# EAGLE design BaseBoard (EAGLE 6.5.0)
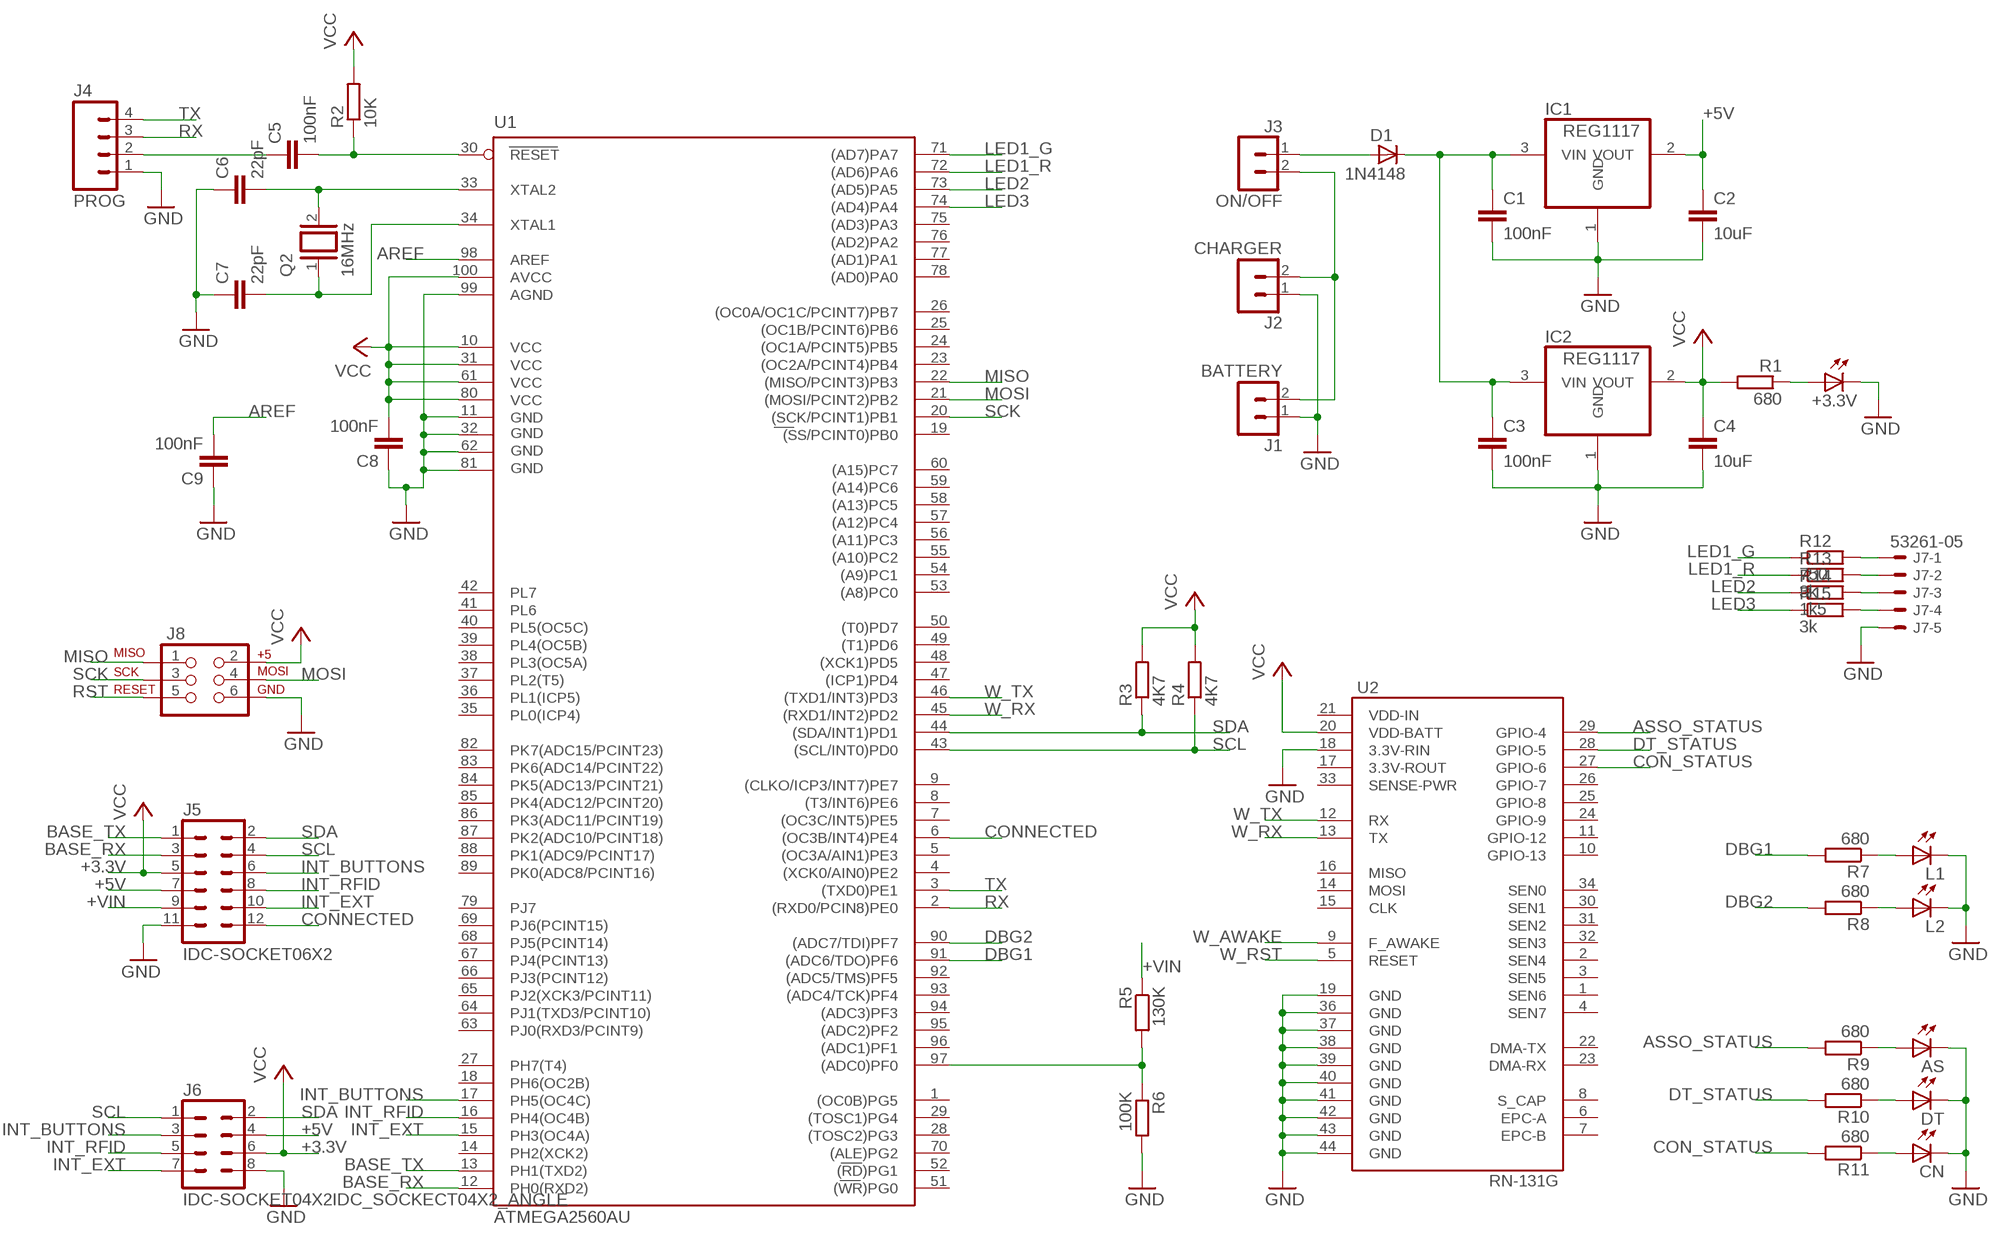
[diagram p0: schematic, sheet 1]

## Parts
+3.3V  LEDSML0805  [SML0805]
AS  LEDSML0805  [SML0805]
C1  100nF  C-EUC0805  [C0805]
C2  10uF  C-EUC0805  [C0805]
C3  100nF  C-EUC0805  [C0805]
C4  10uF  C-EUC0805  [C0805]
C5  100nF  C-EUC0805  [C0805]
C6  22pF  C-EUC0805  [C0805]
C7  22pF  C-EUC0805  [C0805]
C8  100nF  C-EUC0805  [C0805]
C9  100nF  C-EUC0805  [C0805]
CN  LEDSML0805  [SML0805]
D1  1N4148  [D0805]
DT  LEDSML0805  [SML0805]
IC1  REG1117  [SOT223]
IC2  REG1117  [SOT223]
J1  BATTERY  CON02  [CON_2P_SMD]
J2  CHARGER  CON02  [CON_2P_SMD]
J3  ON/OFF  CON02  [CON_2P_SMD]
J4  PROG  M04PTH  [1X04]
J5  IDC-SOCKET06X2  [SOCKET06X2]
J6  IDC-SOCKET04X2IDC_SOCKECT04X2_ANGLE  [SOCKET04X2_ANGLE]
J7  53261-05  [53261-05]
J8  AVR_SPI_PRG_6NS  [2X3-NS]
L1  LEDSML0805  [SML0805]
L2  LEDSML0805  [SML0805]
Q2  16MHz  XTAL/S  [QS]
R1  680  R-EU_R0805  [R0805]
R2  10K  R-EU_R0805  [R0805]
R3  4K7  R-EU_R0805  [R0805]
R4  4K7  R-EU_R0805  [R0805]
R5  130K  R-EU_R0805  [R0805]
R6  100K  R-EU_R0805  [R0805]
R7  680  R-EU_R0805  [R0805]
R8  680  R-EU_R0805  [R0805]
R9  680  R-EU_R0805  [R0805]
R10  680  R-EU_R0805  [R0805]
R11  680  R-EU_R0805  [R0805]
R12  750  R-EU_R0805  [R0805]
R13  3k  R-EU_R0805  [R0805]
R14  1k5  R-EU_R0805  [R0805]
R15  3k  R-EU_R0805  [R0805]
U1  ATMEGA2560AU  [TQFP100]
U2  RN-131G  [RN-131G]

## Nets
+5V: C2.1 IC1.2(VOUT) J5.7 J6.4
+VIN: C1.1 C3.1 D1.C IC1.3(VIN) IC2.3(VIN) J5.9 R5.1
AREF: C9.2 U1.98(AREF)
ASSO_STATUS: R9.2 U2.29(GPIO-4)
BASE_RX: J5.3 U1.12(PH0(RXD2))
BASE_TX: J5.1 U1.13(PH1(TXD2))
BAT: R5.2 R6.1 U1.97((ADC0)PF0)
CON_STATUS: R11.2 U2.27(GPIO-6)
CONNECTED: J5.12 U1.6((OC3B/INT4)PE4)
DBG1: R7.2 U1.91((ADC6/TDO)PF6)
DBG2: R8.2 U1.90((ADC7/TDI)PF7)
DT_STATUS: R10.2 U2.28(GPIO-5)
GND: +3.3V.C AS.C C1.2 C2.2 C3.2 C4.2 C6.1 C7.1 C8.1 C9.1 CN.C DT.C IC1.1(GND) IC2.1(GND) J1.1 J2.1 J4.1 J5.11 J6.8 J7.5 J8.6 L1.C L2.C R6.2 U1.11(GND) U1.32(GND1) U1.62(GND2) U1.81(GND3) U1.99(AGND) U2.18(3.3V-RIN) U2.19(GND) U2.36(GND) U2.37(GND) U2.38(GND) U2.39(GND) U2.40(GND) U2.41(GND) U2.42(GND) U2.43(GND) U2.44(GND)
INT_BUTTONS: J5.6 J6.3 U1.17(PH5(OC4C))
INT_EXT: J5.10 J6.7 U1.15(PH3(OC4A))
INT_RFID: J5.8 J6.5 U1.16(PH4(OC4B))
LED1_G: R12.1 U1.71((AD7)PA7)
LED1_R: R13.1 U1.72((AD6)PA6)
LED2: R14.1 U1.73((AD5)PA5)
LED3: R15.1 U1.74((AD4)PA4)
MISO: J8.1 U1.22((MISO/PCINT3)PB3)
MOSI: J8.4 U1.21((MOSI/PCINT2)PB2)
N$1: AS.A R9.1
N$2: D1.A J3.1
N$3: J1.2 J2.2 J3.2
N$4: DT.A R10.1
N$5: C5.1 J4.2
N$6: J7.1 R12.2
N$7: C7.2 Q2.1 U1.34(XTAL1)
N$8: C6.2 Q2.2 U1.33(XTAL2)
N$9: CN.A R11.1
N$10: +3.3V.A R1.1
N$11: J7.2 R13.2
N$12: J7.3 R14.2
N$13: J7.4 R15.2
N$14: L1.A R7.1
N$15: L2.A R8.1
RST: C5.2 J8.5 R2.1 U1.30(RESET)
RX: J4.3 U1.2((RXD0/PCIN8)PE0)
SCK: J8.3 U1.20((SCK/PCINT1)PB1)
SCL: J5.4 J6.1 R4.1 U1.43((SCL/INT0)PD0)
SDA: J5.2 J6.2 R3.1 U1.44((SDA/INT1)PD1)
TX: J4.4 U1.3((TXD0)PE1)
VCC: C4.1 C8.2 IC2.2(VOUT) J5.5 J6.6 J8.2 R1.2 R2.2 R3.2 R4.2 U1.10(VCC) U1.31(VCC1) U1.61(VCC2) U1.80(VCC3) U1.100(AVCC) U2.20(VDD-BATT)
W_AWAKE: U2.9(F_AWAKE)
W_RST: U2.5(RESET)
W_RX: U1.45((RXD1/INT2)PD2) U2.13(TX)
W_TX: U1.46((TXD1/INT3)PD3) U2.12(RX)
Unconnected: U1.1((OC0B)PG5) U1.4((XCK0/AIN0)PE2) U1.5((OC3A/AIN1)PE3) U1.7((OC3C/INT5)PE5) U1.8((T3/INT6)PE6) U1.9((CLKO/ICP3/INT7)PE7) U1.14(PH2(XCK2)) U1.18(PH6(OC2B)) U1.19((SS/PCINT0)PB0) U1.23((OC2A/PCINT4)PB4) U1.24((OC1A/PCINT5)PB5) U1.25((OC1B/PCINT6)PB6) U1.26((OC0A/OC1C/PCINT7)PB7) U1.27(PH7(T4)) U1.28((TOSC2)PG3) U1.29((TOSC1)PG4) U1.35(PL0(ICP4)) U1.36(PL1(ICP5)) U1.37(PL2(T5)) U1.38(PL3(OC5A)) U1.39(PL4(OC5B)) U1.40(PL5(OC5C)) U1.41(PL6) U1.42(PL7) U1.47((ICP1)PD4) U1.48((XCK1)PD5) U1.49((T1)PD6) U1.50((T0)PD7) U1.51((WR)PG0) U1.52((RD)PG1) U1.53((A8)PC0) U1.54((A9)PC1) U1.55((A10)PC2) U1.56((A11)PC3) U1.57((A12)PC4) U1.58((A13)PC5) U1.59((A14)PC6) U1.60((A15)PC7) U1.63(PJ0(RXD3/PCINT9)) U1.64(PJ1(TXD3/PCINT10)) U1.65(PJ2(XCK3/PCINT11)) U1.66(PJ3(PCINT12)) U1.67(PJ4(PCINT13)) U1.68(PJ5(PCINT14)) U1.69(PJ6(PCINT15)) U1.70((ALE)PG2) U1.75((AD3)PA3) U1.76((AD2)PA2) U1.77((AD1)PA1) U1.78((AD0)PA0) U1.79(PJ7) U1.82(PK7(ADC15/PCINT23)) U1.83(PK6(ADC14/PCINT22)) U1.84(PK5(ADC13/PCINT21)) U1.85(PK4(ADC12/PCINT20)) U1.86(PK3(ADC11/PCINT19)) U1.87(PK2(ADC10/PCINT18)) U1.88(PK1(ADC9/PCINT17)) U1.89(PK0(ADC8/PCINT16)) U1.92((ADC5/TMS)PF5) U1.93((ADC4/TCK)PF4) U1.94((ADC3)PF3) U1.95((ADC2)PF2) U1.96((ADC1)PF1) U2.1(SEN6) U2.2(SEN4) U2.3(SEN5) U2.4(SEN7) U2.6(EPC-A) U2.7(EPC-B) U2.8(S_CAP) U2.10(GPIO-13) U2.11(GPIO-12) U2.14(MOSI) U2.15(CLK) U2.16(MISO) U2.17(3.3V-ROUT) U2.21(VDD-IN) U2.22(DMA-TX) U2.23(DMA-RX) U2.24(GPIO-9) U2.25(GPIO-8) U2.26(GPIO-7) U2.30(SEN1) U2.31(SEN2) U2.32(SEN3) U2.33(SENSE-PWR) U2.34(SEN0)

## Notes on the sheet
- +3.3V
- +3.3V

## Library data of the parts
+3.3V AS CN DT L1 L2 = led:LED: LED OSRAM: - CHIPLED LG R971, LG N971, LY N971, LG Q971, LY Q971, LO R971, LY R971 LH N974, LH R974 LS Q976, LO Q976, LY Q976 LO Q996 - Hyper CHIPLED LW Q18S LB Q993, LB Q99A, LB R99A - SideLED LS A670, LO A670, LY A670, LG A670, LP A670 LB A673, LV A673, LT A673, LW A673 LH A674 LY A675 LS A676, LA A676, LO A676, LY A676, LW A676 LS A679, LY A679, LG A679 - Hyper Micro SIDELED® LS Y876, LA Y876, LO Y876, LY Y876 LT Y87S - SmartLED LW L88C, LW L88S LB L89C, LB L89S, LG L890 LS L89K, LO L89K, LY L89K LS L896, LA L896, LO L896, LY L896 - TOPLED LS T670, LO T670, LY T670, LG T670, LP T670 LSG T670, LSP T670, LSY T670, LOP T670, LYG T670 LG T671, LOG T671, LSG T671 LB T673, LV T673, LT T673, LW T673 LH T674 LS T676, LA T676, LO T676, LY T676, LB T676, LH T676, LSB T676, LW T676 LB T67C, LV T67C, LT T67C, LS T67K, LO T67K, LY T67K, LW E67C LS E67B, LA E67B, LO E67B, LY E67B, LB E67C, LV E67C, LT E67C LW T67C LS T679, LY T679, LG T679 LS T770, LO T770, LY T770, LG T770, LP T770 LB T773, LV T773, LT T773, LW T773 LH T774 LS E675, LA E675, LY E675, LS T675 LS T776, LA T776, LO T776, LY T776, LB T776 LHGB T686 LT T68C, LB T68C - Hyper Mini TOPLED® LB M676 - Mini TOPLED Santana® LG M470 LS M47K, LO M47K, LY M47K Source: http://www.osram.convergy.de LUXEON: - LUMILED® LXK2-PW12-R00, LXK2-PW12-S00, LXK2-PW14-U00, LXK2-PW14-V00 LXK2-PM12-R00, LXK2-PM12-S00, LXK2-PM14-U00 LXK2-PE12-Q00, LXK2-PE12-R00, LXK2-PE12-S00, LXK2-PE14-T00, LXK2-PE14-U00 LXK2-PB12-K00, LXK2-PB12-L00, LXK2-PB12-M00, LXK2-PB14-N00, LXK2-PB14-P00, LXK2-PB14-Q00 LXK2-PR12-L00, LXK2-PR12-M00, LXK2-PR14-Q00, LXK2-PR14-R00 LXK2-PD12-Q00, LXK2-PD12-R00, LXK2-PD12-S00 LXK2-PH12-R00, LXK2-PH12-S00 LXK2-PL12-P00, LXK2-PL12-Q00, LXK2-PL12-R00 Source: www.luxeon.com KINGBRIGHT: KA-3528ASYC Source: www.kingbright.com
C1-C9 = resistor:C-EU: CAPACITOR, European symbol
D1 = Diode:1N4148: DIODE high speed (Philips)
IC1 IC2 = burr-brown:REG1117: 800mA and 1A Low Dropout (LDO) Positive Regulator 1.8V, 2.5V, 2.85V, 3.3V, 5V, and Adj; MPN: REG1117; OC_FARNELL: 1097566; OC_NEWARK: 14P6981
J1-J3 = Connectors:CON02
J4 = SparkFun-Connectors:M04: Header 4 Standard 4-pin 0.1" header. Use with straight break away headers (SKU : PRT-00116), right angle break away headers (PRT-00553), swiss pins (PRT-00743), machine pins (PRT-00117), and female headers (PRT-00115). Molex polarized connector foot print use with SKU : PRT-08231 with associated crimp pins and housings. 1MM SMD Version SKU: PRT-10208
J5 = Connectors:IDC-SOCKET06X2
J6 = Connectors:IDC-SOCKET04X2
J7 = con-molex:53?-05: CONNECTOR wire to board 1.25 mm (.049 inch) pitch header; OC_FARNELL: 1433644; OC_NEWARK: unknown
J8 = SparkFun-Connectors:AVR_SPI_PRG_6: AVR ISP 6 Pin This is the reduced ISP connector for AVR programming. Common on Arduino. This footprint will take up less PCB space and can be used with a 10-pin to 6-pin adapter such as SKU: BOB-08508
Q2 = special:XTAL/S: CRYSTAL
R1-R15 = resistor:R-EU_: RESISTOR, European symbol
U1 = SparkFun-DigitalIC:ATMEGA2560: Atmel 100-pin 8-bit uC 64/128/256 Kbytes FLASH 4 Kbytes EEPROM 8 Kbytes SRAM 86 General Purpose I/O pins 12-channels16-bit PWM 4 x Serial USARTs 16-channels 10-bit A/D
U2 = WiFly:RN-131G: Roving Netowrks WiFLy GSX Module

## Board
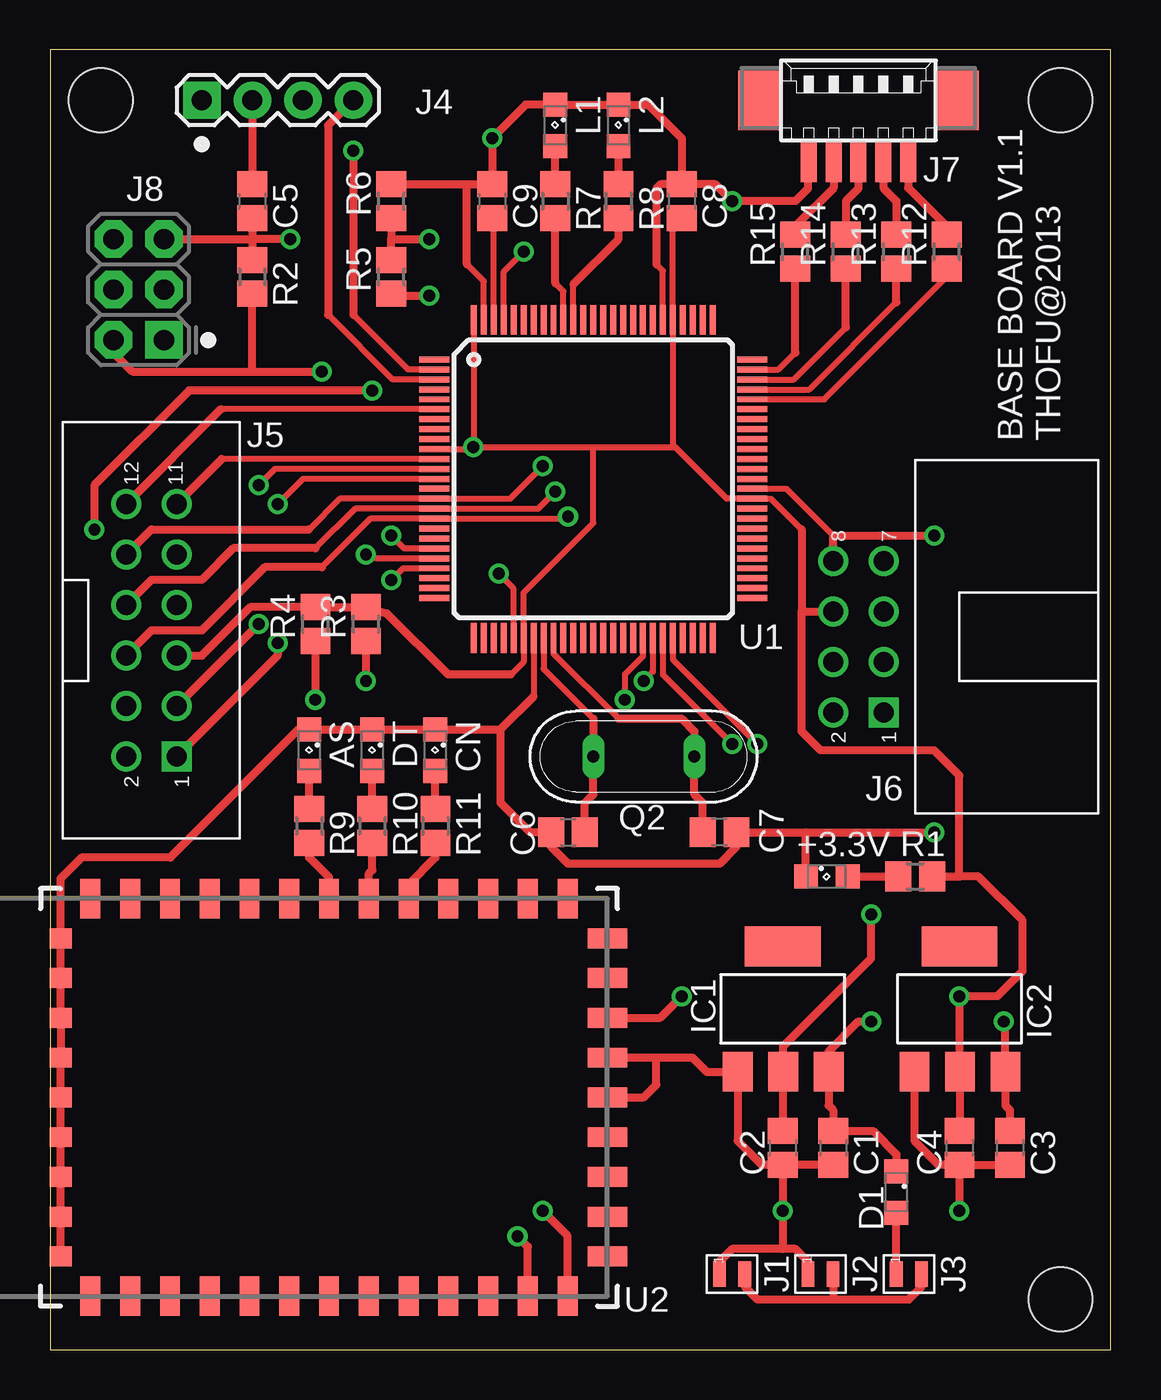
[diagram p1: board, top side]
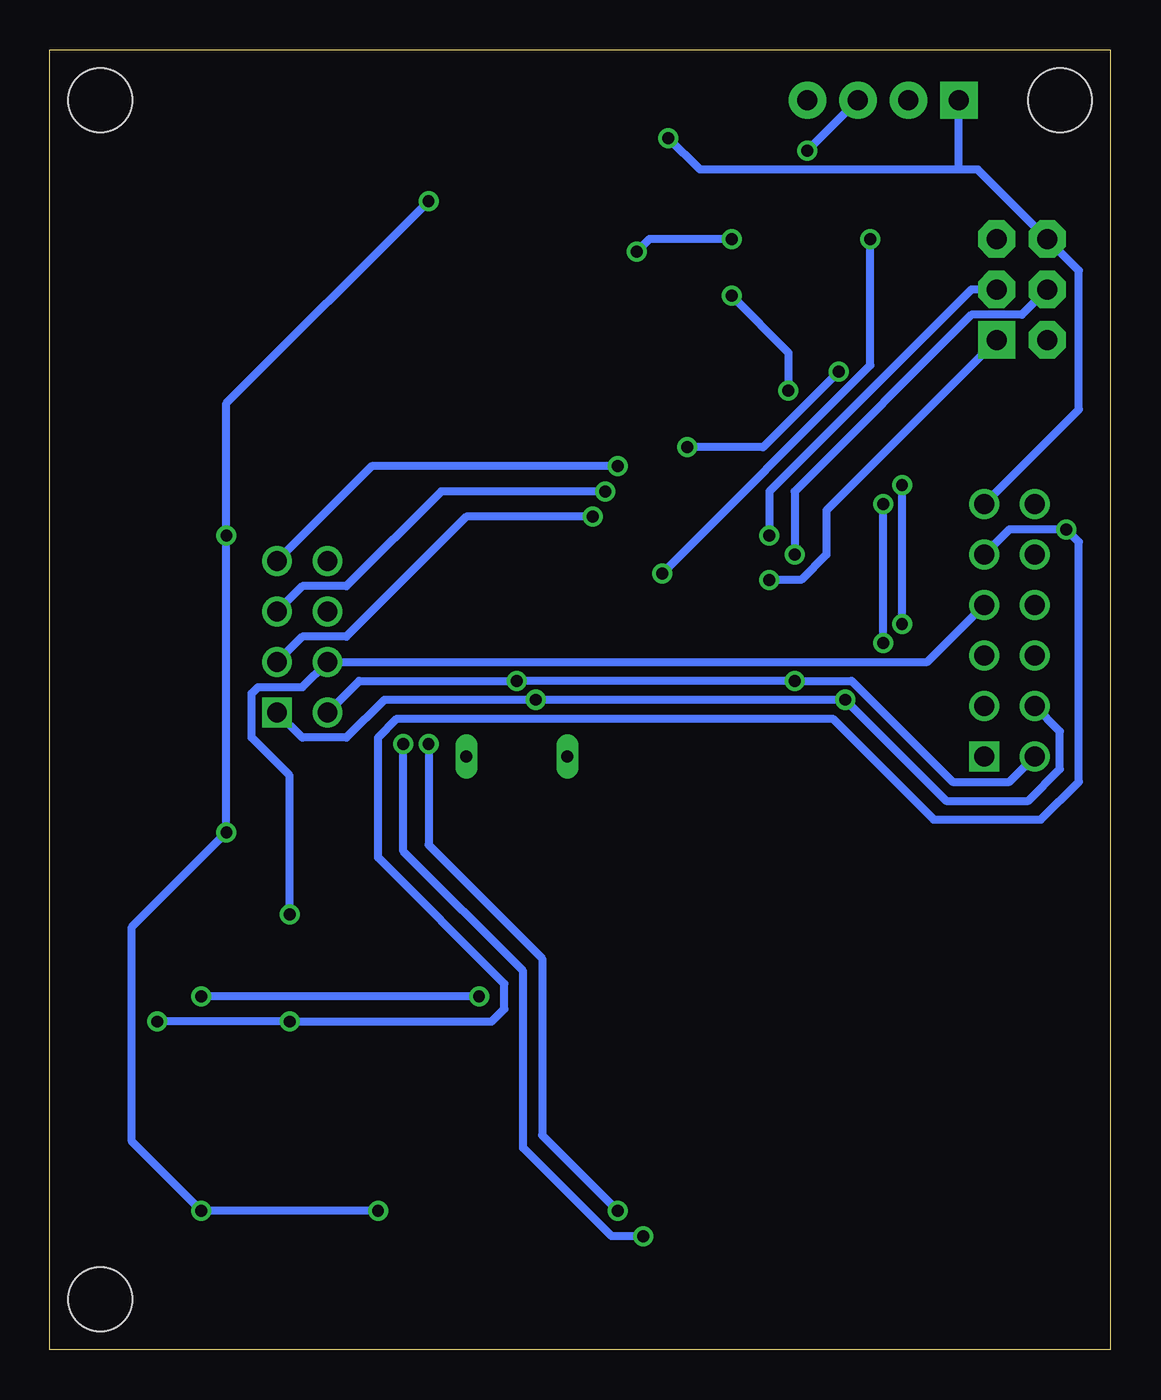
[diagram p2: board, bottom side, seen from below]

Size 53.34 x 65.41 mm. Coordinates in mm from the lower left corner, seen from the top.
Outline: 0,0 53.34,0 53.34,65.41 0,65.41 0,0
Copper layers (1*16): Top 0.035mm / dielectric 1.5mm / Bottom 0.035mm
Design rules "default": minimum track width 10mil, minimum drill 24mil, track to track 8mil, track to pad 8mil, pad to pad 8mil, via to via 8mil, smd to smd 8mil, copper to edge 40mil, drill to drill 8mil, minimum pad ring 10mil, minimum via ring 8mil, stop-mask expansion 4mil, vias tented up to drill 0mil, thermal gap 10mil
Holes 3.2 mm at 2.54,62.87 50.8,2.54 50.8,62.87

### Footprints (pad centres in the part's own frame; a part is rotated, then mirrored left to right if it is on the bottom)
SML0805 = smd 1.2 x 1.2: A 1.05,0; C -1.05,0
C0805 = smd 1.3 x 1.5: 1 -0.85,0; 2 0.85,0
D0805 = smd 1.2 x 1.2: A 1.05,0; C -1.05,0
SOT223 = smd 1.499 x 2.007: 1 -2.261,-3.15; 2 0.025,-3.15; 3 2.311,-3.15 | smd 3.81 x 2.007: 4 0,3.15
CON_2P_SMD = smd 1.27 x 0.635: 1 0,0; 2 0,1.27
1X04 = drill 1.016 pad 1.88 square: 1 0,0 | drill 1.016 pad 1.88: 2 2.54,0; 3 5.08,0; 4 7.62,0
SOCKET06X2 = drill 1 square: 1 -6.35,-1.27 | drill 1: 2 -6.35,1.27; 3 -3.81,-1.27; 4 -3.81,1.27; 5 -1.27,-1.27; 6 -1.27,1.27; 7 1.27,-1.27; 8 1.27,1.27; 9 3.81,-1.27; 10 3.81,1.27; 11 6.35,-1.27; 12 6.35,1.27
SOCKET04X2_ANGLE = drill 1 square: 1 -3.81,-1.27 | drill 1: 2 -3.81,1.27; 3 -1.27,-1.27; 4 -1.27,1.27; 5 1.27,-1.27; 6 1.27,1.27; 7 3.81,-1.27; 8 3.81,1.27
53261-05 = smd 0.8 x 2: 1 2.5,-2.5; 2 1.25,-2.5; 3 0,-2.5; 4 -1.25,-2.5; 5 -2.5,-2.5 | smd 2.1 x 3: S1 5,0.625; S2 -5,0.625
2X3-NS = drill 1.016 pad 1.88 square: 1 -2.54,-1.27 | drill 1.016 pad 1.88 octagon: 2 -2.54,1.27; 3 0,-1.27; 4 0,1.27; 5 2.54,-1.27; 6 2.54,1.27
QS = drill 0.61 long: 1 -2.54,0; 2 2.54,0
R0805 = smd 1.3 x 1.5: 1 -0.85,0; 2 0.85,0
TQFP100 = smd 1.5 x 0.3: 1 -8,6; 2 -8,5.5; 3 -8,5; 4 -8,4.5; 5 -8,4; 6 -8,3.5; 7 -8,3; 8 -8,2.5; 9 -8,2; 10 -8,1.5; 11 -8,1; 12 -8,0.5; 13 -8,0; 14 -8,-0.5; 15 -8,-1; 16 -8,-1.5; 17 -8,-2; 18 -8,-2.5; 19 -8,-3; 20 -8,-3.5; 21 -8,-4; 22 -8,-4.5; 23 -8,-5; 24 -8,-5.5; 25 -8,-6; 51 8,-6; 52 8,-5.5; 53 8,-5; 54 8,-4.5; 55 8,-4; 56 8,-3.5; 57 8,-3; 58 8,-2.5; 59 8,-2; 60 8,-1.5; 61 8,-1; 62 8,-0.5; 63 8,0; 64 8,0.5; 65 8,1; 66 8,1.5; 67 8,2; 68 8,2.5; 69 8,3; 70 8,3.5; 71 8,4; 72 8,4.5; 73 8,5; 74 8,5.5; 75 8,6 | smd 0.3 x 1.5: 26 -6,-8; 27 -5.5,-8; 28 -5,-8; 29 -4.5,-8; 30 -4,-8; 31 -3.5,-8; 32 -3,-8; 33 -2.5,-8; 34 -2,-8; 35 -1.5,-8; 36 -1,-8; 37 -0.5,-8; 38 0,-8; 39 0.5,-8; 40 1,-8; 41 1.5,-8; 42 2,-8; 43 2.5,-8; 44 3,-8; 45 3.5,-8; 46 4,-8; 47 4.5,-8; 48 5,-8; 49 5.5,-8; 50 6,-8; 76 6,8; 77 5.5,8; 78 5,8; 79 4.5,8; 80 4,8; 81 3.5,8; 82 3,8; 83 2.5,8; 84 2,8; 85 1.5,8; 86 1,8; 87 0.5,8; 88 0,8; 89 -0.5,8; 90 -1,8; 91 -1.5,8; 92 -2,8; 93 -2.5,8; 94 -3,8; 95 -3.5,8; 96 -4,8; 97 -4.5,8; 98 -5,8; 99 -5.5,8; 100 -6,8
RN-131G = smd 2 x 1: 1 -10,11; 2 -10,9; 3 -10,7; 4 -10,5; 5 -10,3; 6 -10,1; 7 -10,-1; 8 -10,-3; 9 -10,-5; 10 -10,-7; 11 -10,-9; 12 -10,-11; 13 -10,-13; 23 10,-13; 24 10,-11; 25 10,-9; 26 10,-7; 27 10,-5; 28 10,-3; 29 10,-1; 30 10,1; 31 10,3; 32 10,5; 33 10,7; 34 10,9; 35 10,11 | smd 1 x 2: 14 -8,-15; 15 -6,-15; 16 -4,-15; 17 -2,-15; 18 0,-15; 19 2,-15; 20 4,-15; 21 6,-15; 22 8,-15 | smd 1 x 1.11: 36 8,12.492; 37 6,12.492; 38 4,12.492; 39 2,12.492; 40 0,12.492; 41 -2,12.492; 42 -4,12.492; 43 -6,12.492; 44 -8,12.492

### Placement (x,y rotation side)
+3.3V  39.05,23.81 0 top
AS  13.02,30.16 270 top
C1  39.37,10.16 270 top
C2  36.83,10.16 270 top
C3  48.26,10.16 270 top
C4  45.72,10.16 270 top
C5  10.16,57.78 270 top
C6  26.04,26.04 0 top
C7  33.66,26.04 180 top
C8  31.75,57.78 270 top
C9  22.23,57.78 270 top
CN  19.37,30.16 270 top
D1  42.55,7.94 270 top
DT  16.19,30.16 270 top
IC1  36.83,17.14 0 top
IC2  45.72,17.14 0 top
J1  33.66,3.81 270 top
J2  38.1,3.81 270 top
J3  42.55,3.81 270 top
J4  7.62,62.87 0 top
J5  5.08,36.2 90 top
J6  40.64,35.88 90 top
J7  40.64,62.23 0 top
J8  4.45,53.34 90 top
L1  25.4,61.59 270 top
L2  28.57,61.59 270 top
Q2  29.84,29.84 180 top
R1  43.5,23.81 0 top
R2  10.16,53.98 270 top
R3  15.88,36.51 90 top
R4  13.34,36.51 90 top
R5  17.14,53.98 90 top
R6  17.14,57.78 90 top
R7  25.4,57.78 270 top
R8  28.57,57.78 270 top
R9  13.02,26.35 270 top
R10  16.19,26.35 270 top
R11  19.37,26.35 270 top
R12  45.09,55.24 90 top
R13  42.55,55.24 90 top
R14  40.01,55.24 90 top
R15  37.47,55.24 90 top
U1  27.3,43.81 0 top
U2  13.02,12.7 90 top

### Tracks (layer width: path | path; a pad name or v marks a point on that pad's centre or on a via)
+5V  (via drill 0.6)
  Top 0.406: C2.1 36.83,13.99 IC1.2 36.85,15.27 41.27,19.68 v41.27,21.91
  Bottom 0.406: v41.27,21.91 41.27,28.89 43.18,30.8 43.18,33.02 42.86,33.34 40.64,33.34 J6.4 9.21,34.61 J5.7
+VIN  (via drill 0.6)
  Top 0.406: C3.1 48.26,12.06 48.03,12.29 IC2.3 48.03,16.42 v47.94,16.51 | v41.27,16.51 40.64,16.51 39.14,15.01 IC1.3 39.14,12.29 39.37,12.06 C1.1 41.38,11.01 42.55,9.84 D1.C | R5.1 17.25,53.02 v19.05,53.02 | v16.19,48.26 6.99,48.26 2.22,43.5 v2.22,41.27
  Bottom 0.406: v47.94,16.51 v41.27,16.51 31.11,16.51 30.48,17.14 30.48,18.41 36.83,24.77 36.83,30.8 35.88,31.75 13.97,31.75 8.89,26.67 3.49,26.67 1.59,28.57 1.59,40.64 v2.22,41.27 5.08,41.27 J5.9 | v19.05,53.02 16.19,50.16 v16.19,48.26
AREF
  Top 0.305: U1.98 22.3,56.94 C9.2
ASSO_STATUS
  Top 0.406: U2.29 14.02,23.77 13.02,24.77 R9.2
BASE_RX  (via drill 0.6)
  Top 0.305: U1.12 11.29,44.31 v10.48,43.5
  Top 0.406: v10.48,36.51 J5.3
  Bottom 0.406: v10.48,36.51 v10.48,43.5
BASE_TX  (via drill 0.6)
  Top 0.305: U1.13 12.7,43.81 v11.43,42.55
  Top 0.406: v11.43,35.56 11.43,34.92 J5.1
  Bottom 0.406: v11.43,35.56 v11.43,42.55
BAT  (via drill 0.6)
  Top 0.305: U1.97 22.8,54.24 v23.81,55.24
  Top 0.406: R6.1 17.14,55.88 | R5.2 17.14,55.88 | 17.14,55.88 v19.05,55.88
  Bottom 0.406: v19.05,55.88 23.18,55.88 v23.81,55.24
CON_STATUS
  Top 0.406: U2.27 18.02,23.41 19.37,24.77 R11.2
CONNECTED
  Top 0.305: U1.6 8.58,47.31
  Top 0.406: 8.58,47.31 J5.12
DBG1
  Top 0.305: U1.91 25.8,53.25 25.4,53.66
  Top 0.406: 25.4,53.66 R7.2
DBG2
  Top 0.305: U1.90 26.3,53.61
  Top 0.406: 26.3,53.61 28.57,55.88 R8.2
DT_STATUS
  Top 0.406: U2.28 16.02,23.95 16.19,24.13 R10.2
GND  (via drill 0.6)
  Top 0.305: U1.99 21.8,53.76 20.95,54.61 | U1.81 30.8,54.28 30.48,54.61 | U1.11 8.62,44.81 | U1.32 24.3,32.88 | U1.62 37.01,43.31 39.37,40.96
  Top 0.406: C2.2 35.77,9.31 34.57,10.52 IC1.1 34.54,13.97 33.02,13.97 32.29,14.7 30.48,14.7 | C4.2 C3.2 | U2.44 U2.43 U2.42 U2.41 U2.40 U2.39 U2.38 U2.37 U2.36 0.53,23.7 1.59,24.77 6.03,24.77 12.48,31.21 AS.C DT.C CN.C 22.64,31.21 | J1.1 33.66,4.45 34.29,5.08 36.83,5.08 | J7.5 38.1,59.69 38.1,58.42 37.47,57.78 v34.29,57.78 33.44,58.63 C8.1 | C8.1 31.75,60.96 30.07,62.65 L2.C L1.C 23.91,62.65 v22.23,60.96 C9.1 20.95,58.63 | C8.1 30.7,58.63 30.48,58.42 30.48,54.61 | C4.2 v45.72,6.99 | 24.3,32.88 22.64,31.21 | 22.64,31.21 22.64,27.52 24.13,26.04 C6.1 25.18,25.3 26.04,24.45 33.66,24.45 34.51,25.3 C7.1 38,26.04 | J2.1 38.1,4.45 37.47,5.08 36.83,5.08 | 36.83,5.08 v36.83,6.99 C2.2 | IC2.1 43.46,10.52 44.66,9.31 C4.2 | U2.19 30.48,14.7 | 20.95,54.61 20.95,58.63 | R6.2 20.95,58.63 | 38,26.04 v44.45,26.04 | J6.8 39.37,40.96 v44.45,40.96 | C1.2 C2.2 | 8.62,44.81 J5.11 | +3.3V.C 38,26.04 | U2.18 29.84,12.7 30.48,13.34 30.48,14.7
  Bottom 0.406: 7.62,59.37 J4.1 | 7.62,59.37 20.64,59.37 v22.23,60.96 | 7.62,59.37 6.67,59.37 J8.6 1.59,54.29 1.59,47.31 J5.11 | v34.29,57.78 44.45,47.62 v44.45,40.96 v44.45,26.04 49.21,21.27 49.21,10.48 v45.72,6.99 v36.83,6.99
INT_BUTTONS  (via drill 0.6)
  Top 0.305: 13.65,39.37 16.1,41.81 U1.17 25.94,41.81 v26.04,41.91
  Top 0.406: 13.65,39.37 10.79,39.37 7.62,36.2 5.08,36.2 J5.6
  Bottom 0.406: v26.04,41.91 32.38,41.91 38.42,35.88 40.64,35.88 J6.3
INT_EXT  (via drill 0.6)
  Top 0.305: 13.02,41.27 14.56,42.81 U1.15 23.13,42.81 v24.77,44.45
  Top 0.406: J5.10 5.08,41.27 13.02,41.27
  Bottom 0.406: v24.77,44.45 37.15,44.45 J6.7
INT_RFID  (via drill 0.6)
  Top 0.305: 13.34,40.32 15.33,42.31 U1.16 24.54,42.31 v25.4,43.18
  Top 0.406: 13.34,40.32 9.21,40.32 7.62,38.73 5.08,38.73 J5.8
  Bottom 0.406: v25.4,43.18 33.66,43.18 38.42,38.42 40.64,38.42 J6.5
LED1_G
  Top 0.305: U1.71 38.92,47.81 45.09,53.98
  Top 0.406: 45.09,53.98 R12.1
LED1_R
  Top 0.305: U1.72 38.16,48.31 42.55,52.7
  Top 0.406: 42.55,52.7 R13.1
LED2
  Top 0.305: U1.73 37.38,48.81 40.01,51.44
  Top 0.406: 40.01,51.44 R14.1
LED3
  Top 0.305: U1.74 36.62,49.31 37.47,50.16
  Top 0.406: 37.47,50.16 R15.1
MISO  (via drill 0.6)
  Top 0.305: U1.22 17.73,39.31 v17.14,38.73
  Bottom 0.406: J8.1 14.29,42.23 14.29,40.01 15.56,38.73 v17.14,38.73
MOSI  (via drill 0.6)
  Top 0.305: U1.21 16.38,39.81 v15.88,40.01
  Bottom 0.406: J8.4 4.45,52.07 6.99,52.07 15.88,43.18 v15.88,40.01
N$1
  Top 0.406: R9.1 AS.A
N$2
  Top 0.406: J3.1 D1.A
N$3
  Top 0.406: J1.2 34.92,3.17 35.56,2.54 39.37,2.54 | J2.2 39.37,2.54 | 39.37,2.54 43.18,2.54 43.81,3.17 J3.2
N$4
  Top 0.406: R10.1 DT.A
N$5
  Top 0.406: J4.2 C5.1
N$6
  Top 0.406: J7.1 43.14,58.46 45.09,56.52 R12.2
N$7
  Top 0.305: U1.34 25.3,35.02 28.57,31.75
  Top 0.406: 28.57,31.75 31.75,31.75 32.38,31.11 Q2.1 32.38,27.94 32.8,27.52 C7.2
N$8
  Top 0.305: U1.33 24.8,34.25 27.3,31.75
  Top 0.406: 27.3,31.75 Q2.2 27.3,27.94 26.89,27.52 C6.2
N$9
  Top 0.406: R11.1 CN.A
N$10
  Top 0.406: +3.3V.A R1.1
N$11
  Top 0.406: J7.2 41.89,58.44 42.55,57.78 R13.2
N$12
  Top 0.406: J7.3 40.64,58.42 40.01,57.78 R14.2
N$13
  Top 0.406: J7.4 39.39,58.44 37.47,56.52 R15.2
N$14
  Top 0.406: R7.1 L1.A
N$15
  Top 0.406: R8.1 L2.A
RST  (via drill 0.6)
  Top 0.305: U1.30 23.3,38.29 v22.54,39.05
  Top 0.406: C5.2 10.16,55.88 | 10.16,55.88 R2.1 | J8.5 10.16,55.88 | v12.06,55.88 10.16,55.88
  Bottom 0.406: v22.54,39.05 12.06,49.53 v12.06,55.88
RX  (via drill 0.6)
  Top 0.305: U1.2 18,49.31 15.24,52.07
  Top 0.406: v15.24,60.33 15.24,52.07
  Bottom 0.406: J4.3 v15.24,60.33
SCK  (via drill 0.6)
  Top 0.305: U1.20 17.79,40.31 v17.14,40.96
  Bottom 0.406: J8.3 6.99,53.34 17.14,43.18 v17.14,40.96
SCL  (via drill 0.6)
  Top 0.305: U1.43 29.8,34.88 28.89,33.97 v28.89,32.7
  Top 0.406: R4.1 v13.34,32.7
  Bottom 0.406: J5.4 2.54,31.11 2.54,29.21 4.13,27.62 8.26,27.62 v13.34,32.7 v28.89,32.7 36.51,32.7 38.42,30.8 40.64,30.8 J6.1
SDA  (via drill 0.6)
  Top 0.305: U1.44 30.3,34.12 v29.84,33.66
  Top 0.406: R3.1 v15.88,33.66
  Bottom 0.406: J5.2 5.08,28.57 7.94,28.57 13.02,33.66 v15.88,33.66 v29.84,33.66 37.78,33.66 J6.2
TX
  Top 0.305: U1.3 17.23,48.81 13.97,52.07
  Top 0.406: J4.4 13.97,61.59 13.97,52.07
VCC  (via drill 0.6)
  Top 0.305: C8.2 31.3,56.49 U1.80 31.3,45.53 | 23.18,33.97 23.8,34.6 U1.31 23.8,38.09 27.3,41.59 27.3,45.4 | v21.27,45.4 21.18,45.31 U1.10 | 31.3,45.53 31.3,45.4 27.3,45.4 | 31.3,45.53 34.02,42.81 U1.61 36.24,42.81 37.78,41.27 | U1.100 21.3,45.75 v21.27,45.4 | v21.27,45.4 27.3,45.4
  Top 0.406: J8.2 3.17,50.16 4.13,49.21 10.16,49.21 | 10.16,49.21 R2.2 | J5.5 7.62,34.92 10.06,37.36 R4.2 R3.2 16.93,37.05 20,33.97 23.18,33.97 | U2.20 30.67,16.7 v31.75,17.78 | C4.1 45.74,11.04 IC2.2 45.74,17.75 v45.72,17.78 47.62,17.78 48.9,19.05 48.9,21.59 46.67,23.81 45.72,23.81 | 37.78,41.27 37.78,37.15 | 37.78,37.15 J6.6 | 10.16,49.21 v13.65,49.21 | R1.2 45.72,23.81 | 45.72,23.81 45.72,28.89 44.45,30.16 38.73,30.16 37.78,31.11 37.78,37.15
  Bottom 0.406: v31.75,17.78 v45.72,17.78 | v13.65,49.21 17.46,45.4 v21.27,45.4
W_RX  (via drill 0.6)
  Top 0.305: U1.45 30.8,33.97 v34.29,30.48
  Top 0.406: U2.13 26.02,5.73 v24.77,6.99
  Bottom 0.406: v34.29,30.48 34.29,25.4 28.57,19.68 28.57,10.79 v24.77,6.99
W_TX  (via drill 0.6)
  Top 0.305: U1.46 31.3,34.73 v35.56,30.48
  Top 0.406: U2.12 24.02,5.19 v23.5,5.71
  Bottom 0.406: v23.5,5.71 25.08,5.71 29.53,10.16 29.53,19.05 35.56,25.08 v35.56,30.48

### Text on the board
tNames: BASE BOARD V1.1 / THOFU@2013